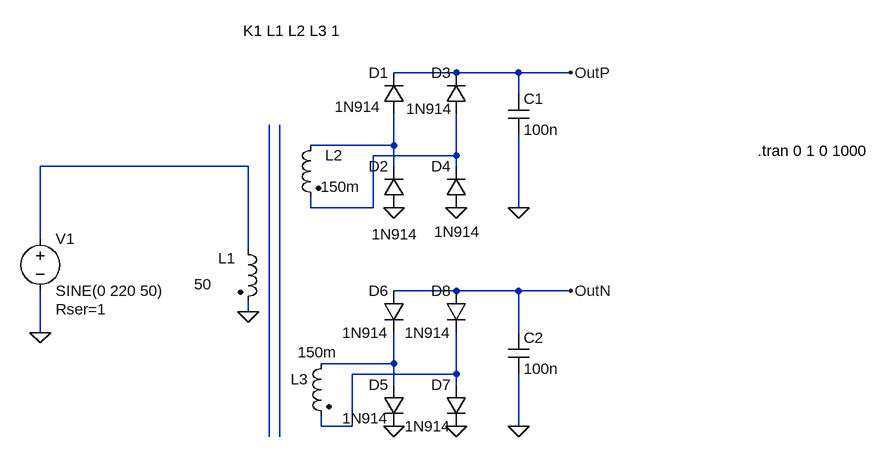
[diagram p0: schematic alim.asc]
alim.asc, the LTspice schematic file:
Version 4
SHEET 1 1188 680
WIRE 512 0 416 0
WIRE 608 0 512 0
WIRE 688 0 608 0
WIRE 608 32 608 0
WIRE 416 112 416 64
WIRE 416 112 288 112
WIRE 512 128 512 64
WIRE 512 128 384 128
WIRE 192 144 -128 144
WIRE 416 144 416 112
WIRE 512 144 512 128
WIRE 288 208 288 192
WIRE 384 208 384 128
WIRE 384 208 288 208
WIRE 608 208 608 96
WIRE -128 256 -128 144
WIRE 192 272 192 144
WIRE 512 336 416 336
WIRE 608 336 512 336
WIRE 688 336 608 336
WIRE 192 368 192 352
WIRE -128 400 -128 336
WIRE 608 400 608 336
WIRE 416 448 416 400
WIRE 416 448 304 448
WIRE 512 464 512 400
WIRE 512 464 352 464
WIRE 416 480 416 448
WIRE 512 480 512 464
WIRE 304 544 304 528
WIRE 352 544 352 464
WIRE 352 544 304 544
WIRE 608 544 608 464
WIRE 224 560 224 80
WIRE 240 560 240 80
FLAG 192 368 0
FLAG -128 400 0
FLAG 416 208 0
FLAG 688 0 OutP
FLAG 512 208 0
FLAG 608 208 0
FLAG 416 544 0
FLAG 512 544 0
FLAG 608 544 0
FLAG 688 336 OutN
SYMBOL ind2 176 256 R0
WINDOW 0 -30 30 Left 2
WINDOW 3 -67 70 Left 2
SYMATTR InstName L1
SYMATTR Value 50
SYMATTR Type ind
SYMBOL ind2 304 96 M0
WINDOW 0 -33 31 Left 2
WINDOW 3 -60 80 Left 2
SYMATTR InstName L2
SYMATTR Value 150m
SYMATTR Type ind
SYMBOL voltage -128 240 R0
WINDOW 123 0 0 Left 0
WINDOW 39 24 124 Left 2
SYMATTR InstName V1
SYMATTR Value SINE(0 220 50)
SYMATTR SpiceLine Rser=1
SYMBOL diode 432 64 R180
WINDOW 0 24 64 Left 2
WINDOW 3 36 11 Left 2
SYMATTR InstName D1
SYMATTR Value 1N914
SYMBOL diode 432 208 R180
WINDOW 0 24 64 Left 2
WINDOW 3 -21 -41 Left 2
SYMATTR InstName D2
SYMATTR Value 1N914
SYMBOL diode 528 64 R180
WINDOW 0 24 64 Left 2
WINDOW 3 22 8 Left 2
SYMATTR InstName D3
SYMATTR Value 1N914
SYMBOL diode 528 208 R180
WINDOW 0 24 64 Left 2
WINDOW 3 -21 -37 Left 2
SYMATTR InstName D4
SYMATTR Value 1N914
SYMBOL cap 592 32 R0
SYMATTR InstName C1
SYMATTR Value 100n
SYMBOL ind2 320 432 M0
WINDOW 3 -9 -2 Left 2
SYMATTR InstName L3
SYMATTR Value 150m
SYMATTR Type ind
SYMBOL diode 432 480 M0
WINDOW 3 24 52 Left 2
SYMATTR InstName D5
SYMATTR Value 1N914
SYMBOL diode 432 336 M0
SYMATTR InstName D6
SYMATTR Value 1N914
SYMBOL diode 528 480 M0
SYMATTR InstName D7
SYMATTR Value 1N914
SYMBOL diode 528 336 M0
SYMATTR InstName D8
SYMATTR Value 1N914
SYMBOL cap 592 464 M180
WINDOW 0 24 56 Left 2
WINDOW 3 24 8 Left 2
SYMATTR InstName C2
SYMATTR Value 100n
TEXT 184 -64 Left 2 !K1 L1 L2 L3 1
TEXT 976 120 Left 2 !.tran 0 1 0 1000

The netlist it stands for:
* alim.asc
L1 N003 0 50
L2 N001 N002 150m
V1 N003 0 SINE(0 220 50) Rser=1
D1 N001 OutP 1N914
D2 0 N001 1N914
D3 N002 OutP 1N914
D4 0 N002 1N914
C1 OutP 0 100n
L3 N004 N005 150m
D5 N004 0 1N914
D6 OutN N004 1N914
D7 N005 0 1N914
D8 OutN N005 1N914
C2 0 OutN 100n
.model D D
.lib standard.dio
K1 L1 L2 L3 1
.tran 0 1 0 1000
.backanno
.end